# Altium schematic sheet 0252_GPU+CORE-PD-BLOCK_.SchDoc
size 848 x 558 mm
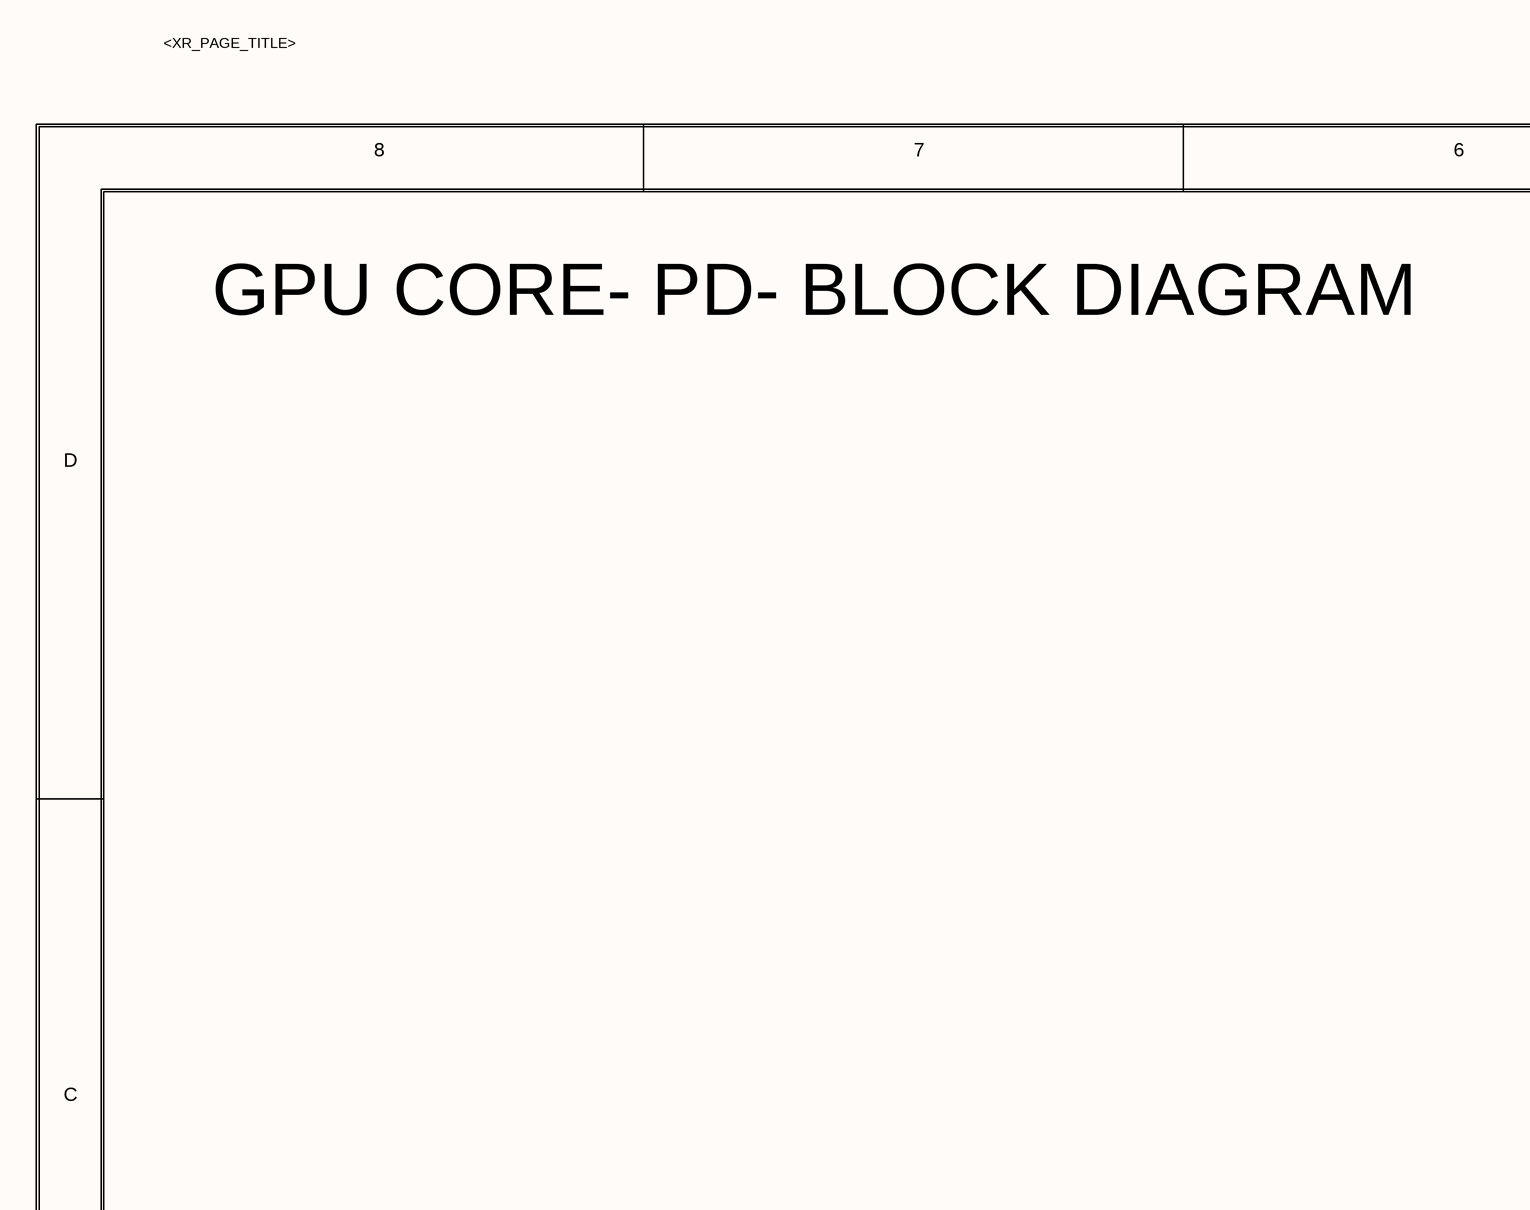
[diagram p0: 0252_GPU+CORE-PD-BLOCK_.SchDoc, top left]
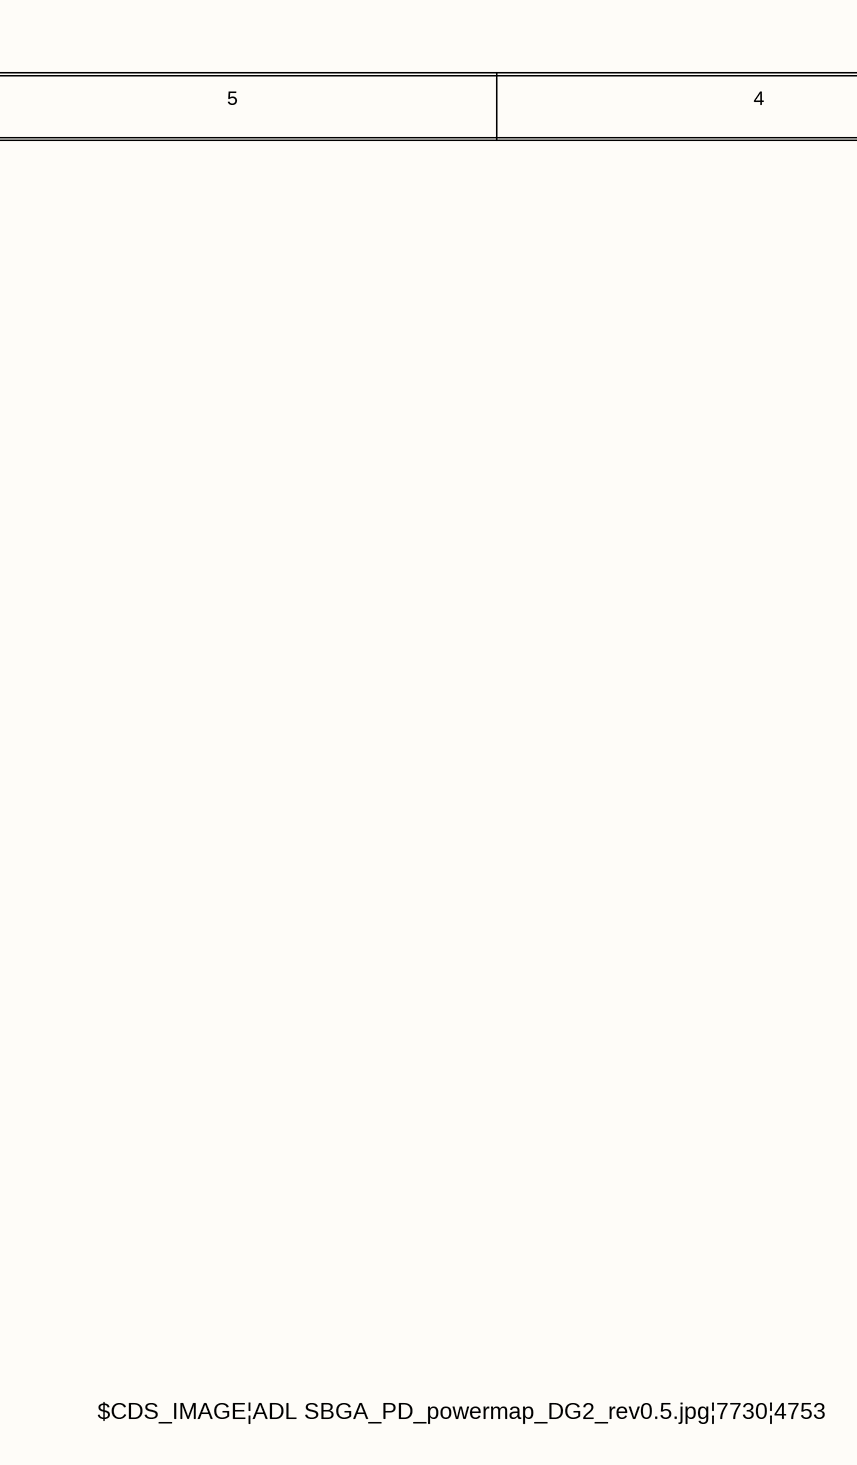
[diagram p1: 0252_GPU+CORE-PD-BLOCK_.SchDoc, top middle]
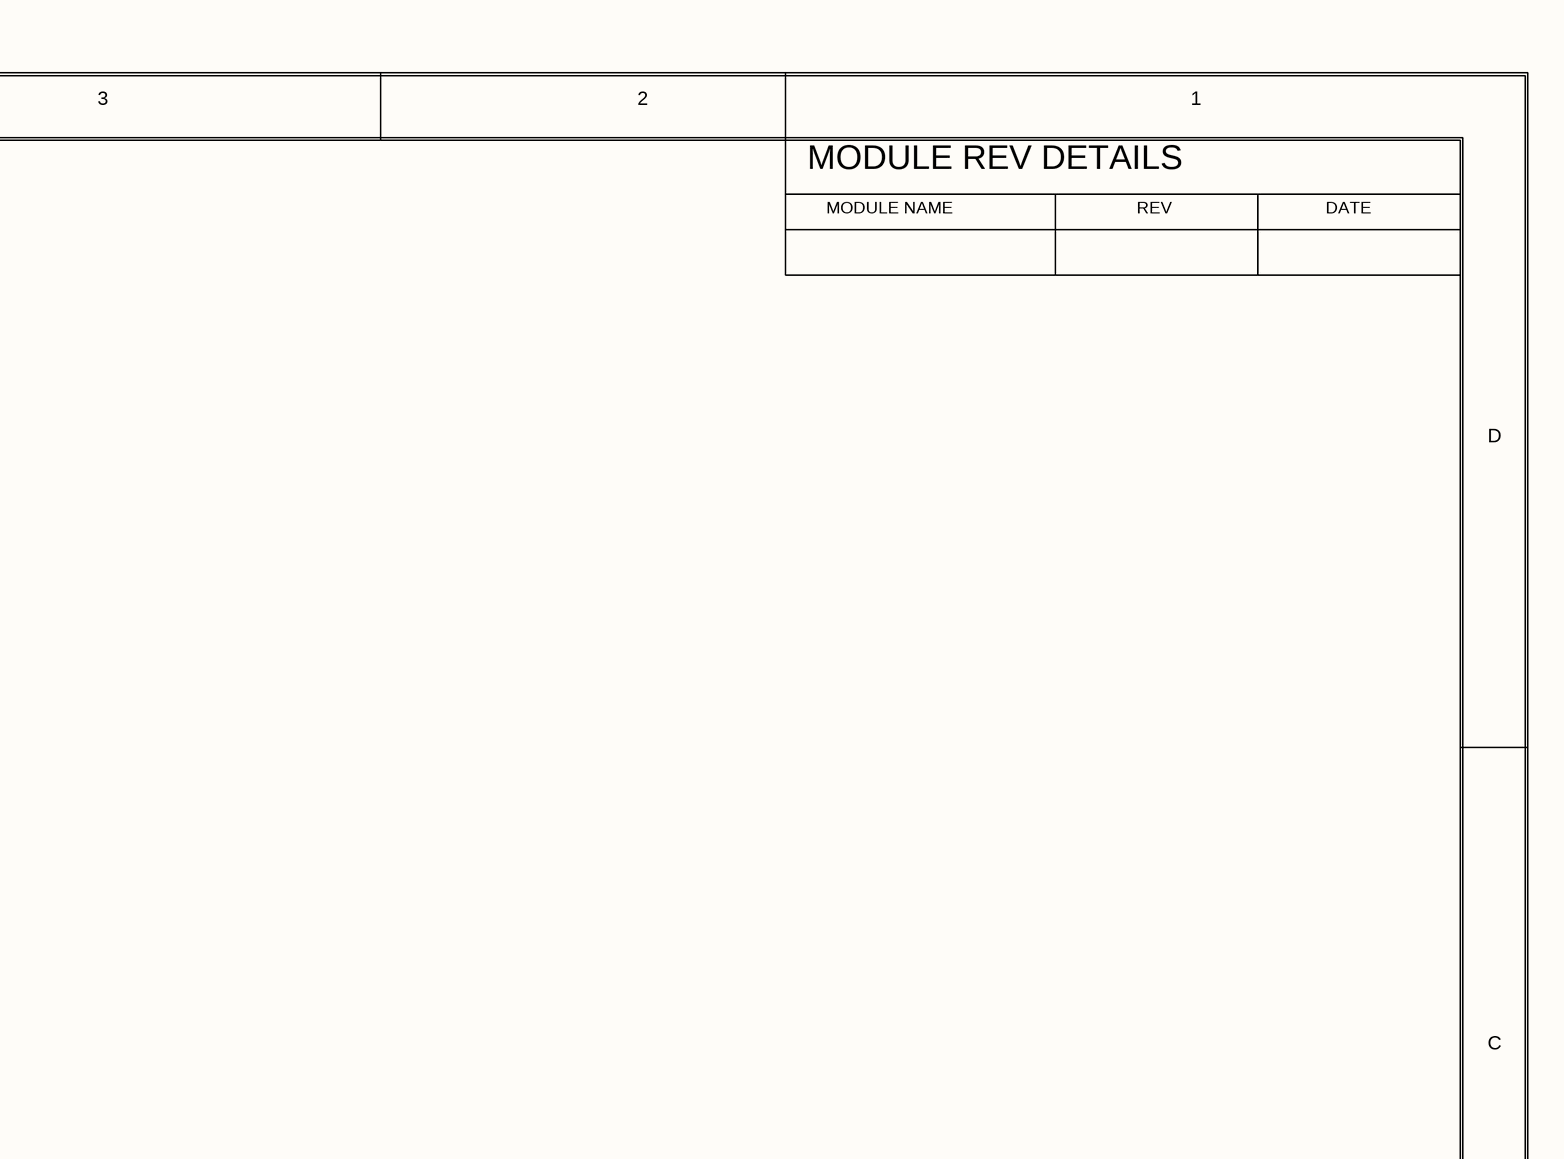
[diagram p2: 0252_GPU+CORE-PD-BLOCK_.SchDoc, top right]
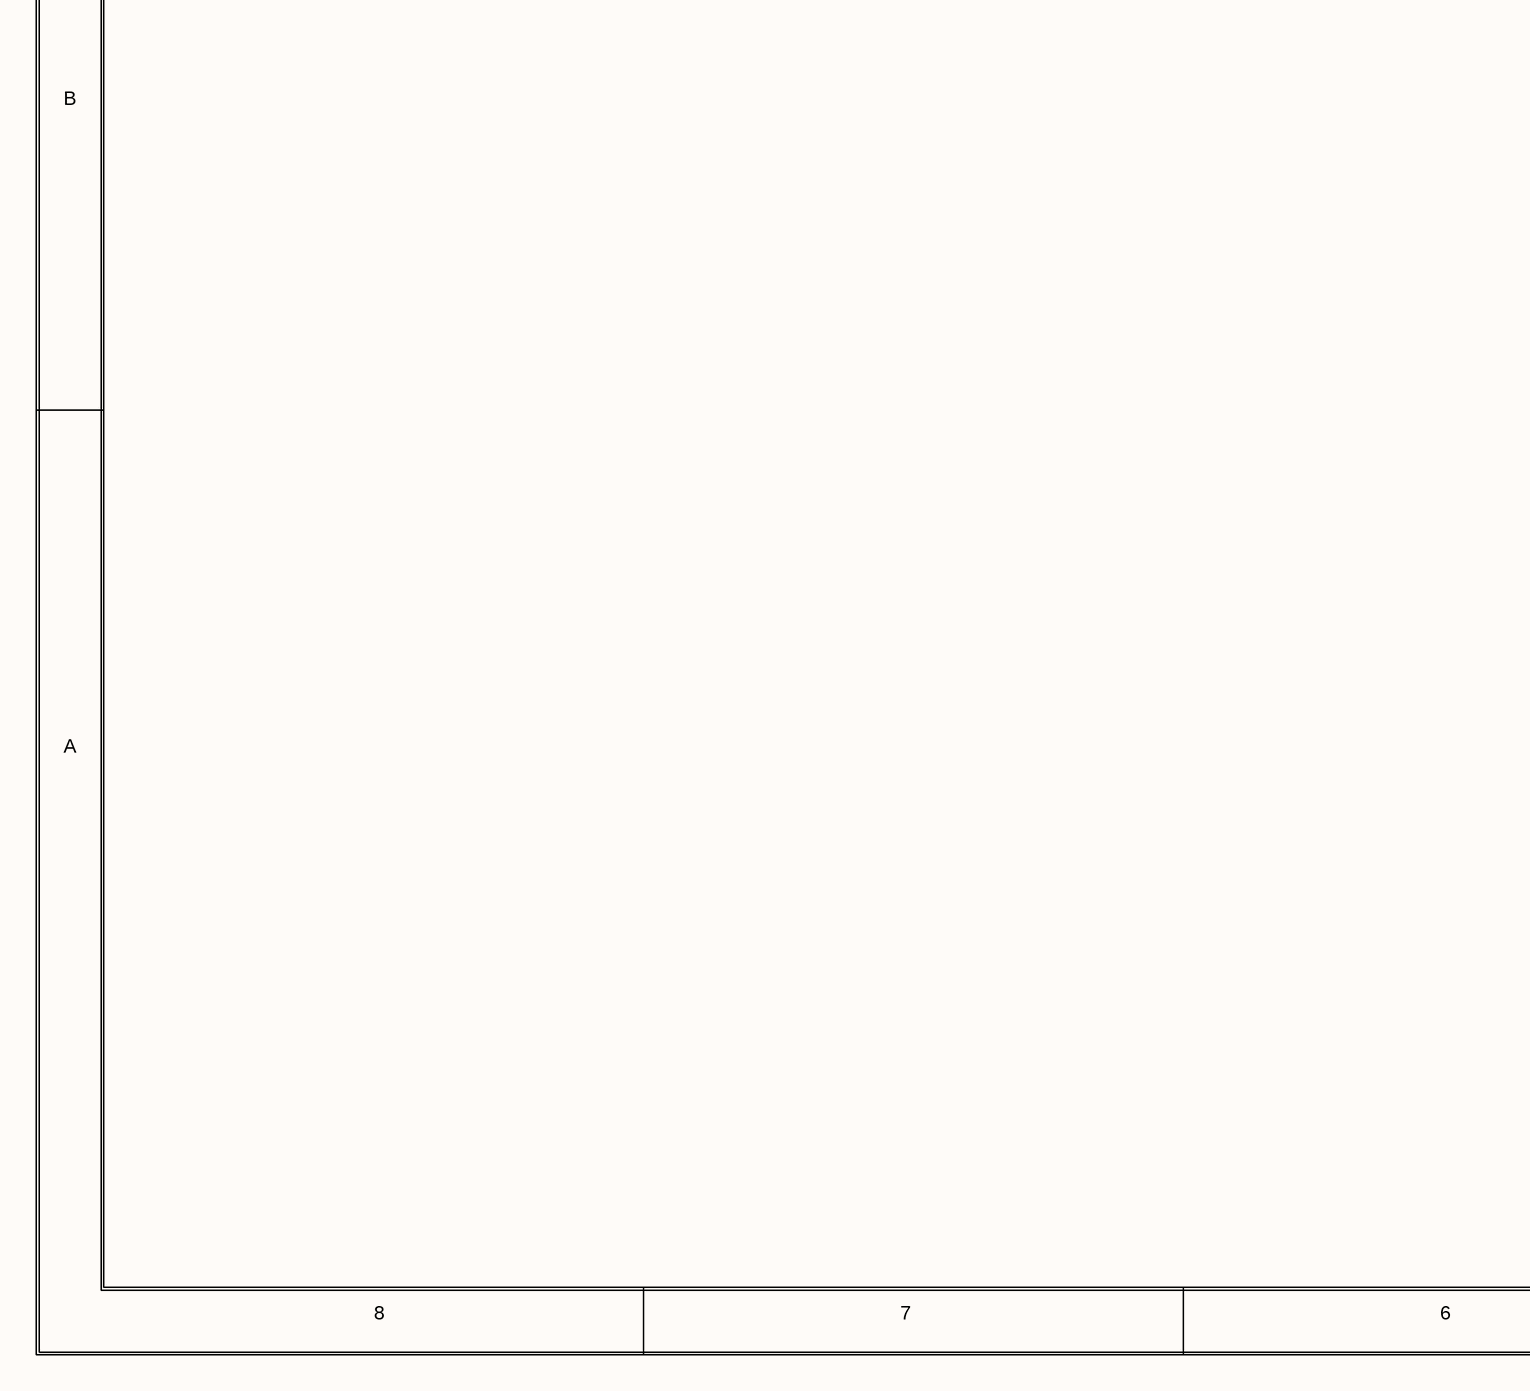
[diagram p3: 0252_GPU+CORE-PD-BLOCK_.SchDoc, bottom left]
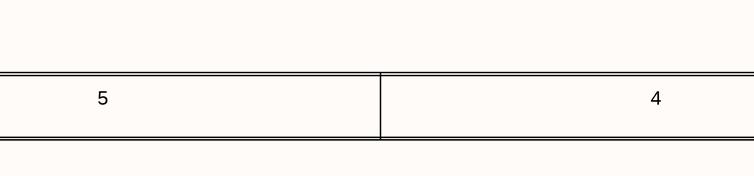
[diagram p4: 0252_GPU+CORE-PD-BLOCK_.SchDoc, bottom middle]
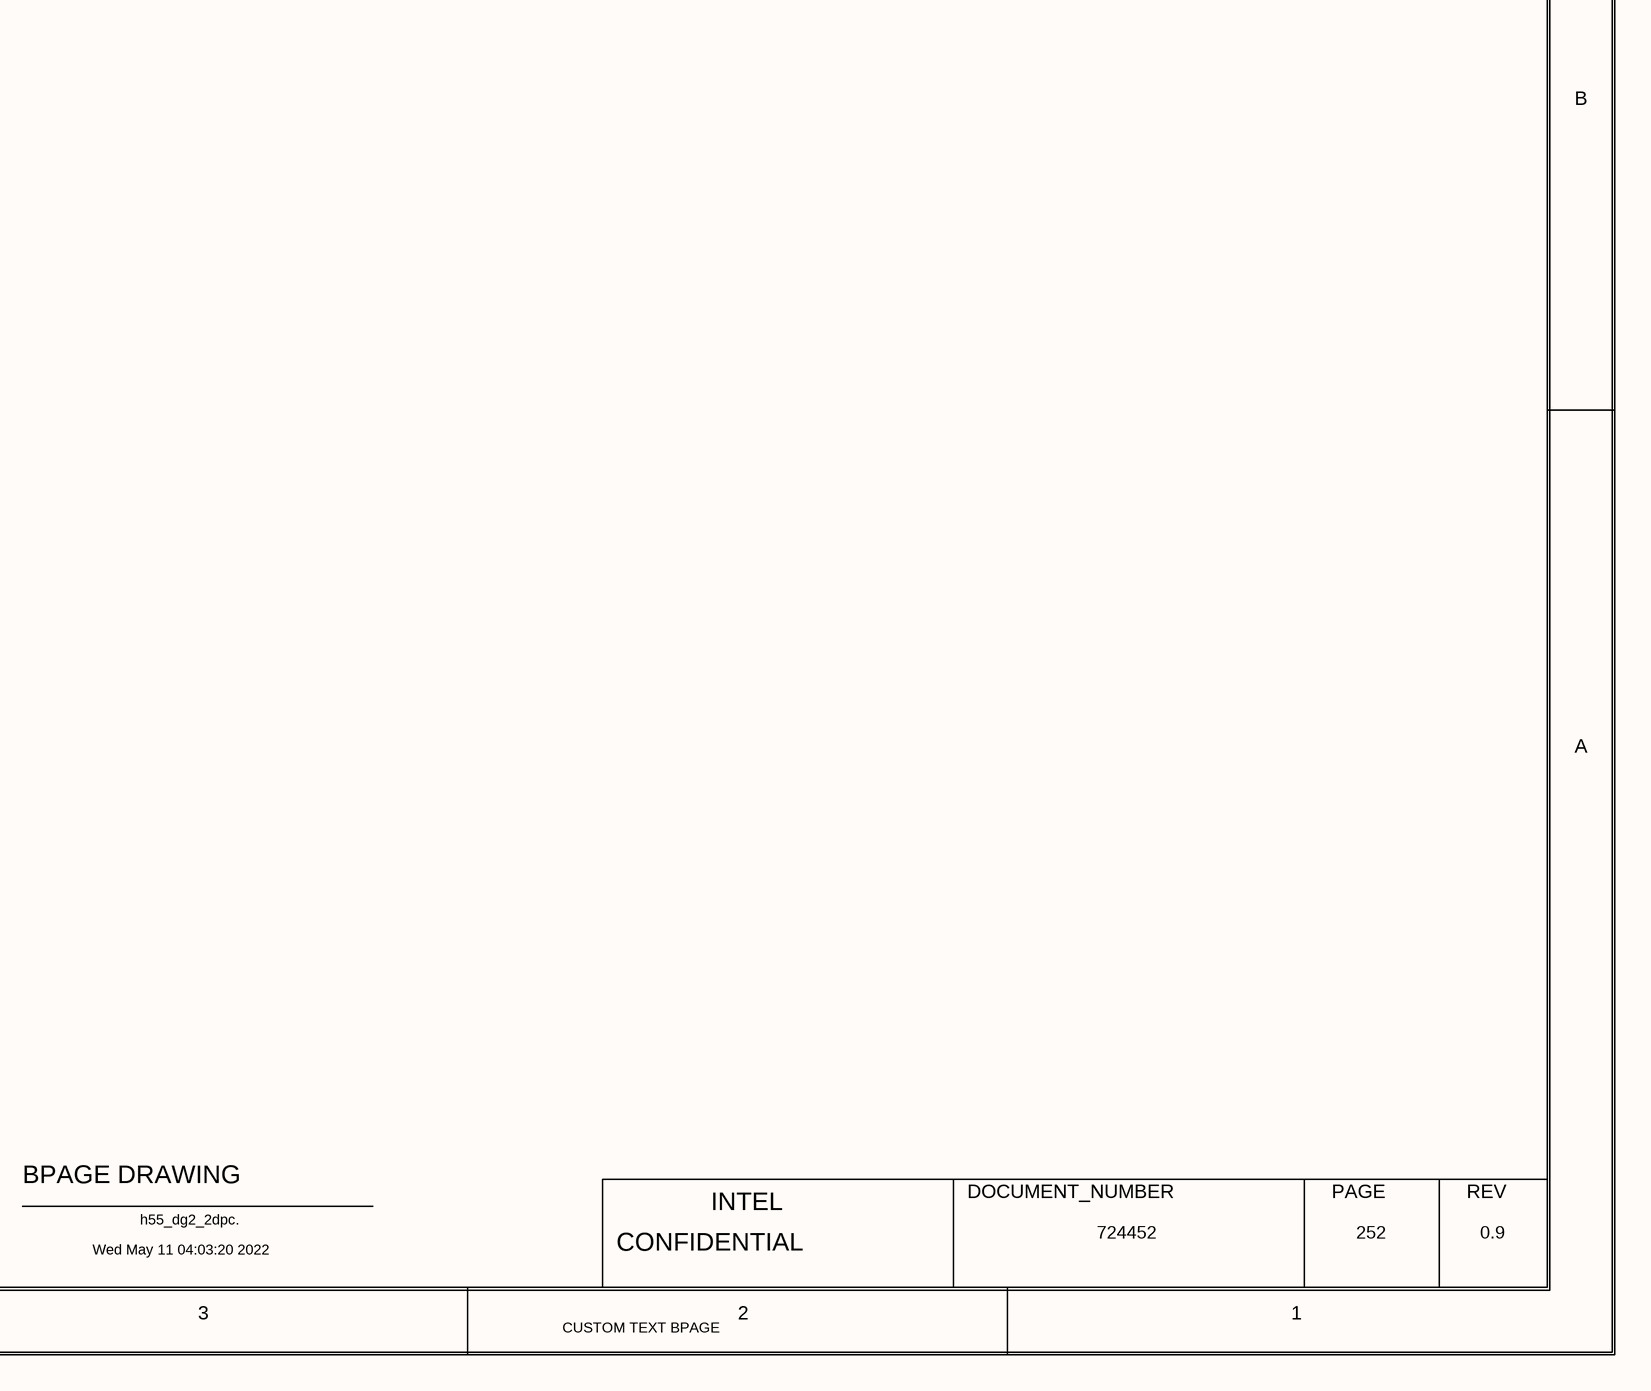
[diagram p5: 0252_GPU+CORE-PD-BLOCK_.SchDoc, bottom right]

## Notes on the sheet
- <XR_PAGE_TITLE>
- 8
- 7
- 6
- 5
- 4
- 3
- 2
- 1
- MODULE REV DETAILS
- GPU CORE- PD- BLOCK DIAGRAM
- MODULE NAME
- REV
- DATE
- D
- C
- $CDS_IMAGE|ADL SBGA_PD_powermap_DG2_rev0.5.jpg|7730|4753
- B
- A
- BPAGE DRAWING
- INTEL
- DOCUMENT_NUMBER
- PAGE
- Wed May 11 04:03:20 2022
- h55_dg2_2dpc.
- CONFIDENTIAL
- 724452
- 252
- 0.9
- CUSTOM TEXT BPAGE